# Altium schematic sheet GitKop.SchDoc
size A4; Author: Paweł Reich; SheetNumber: 1; SheetTotal: 1
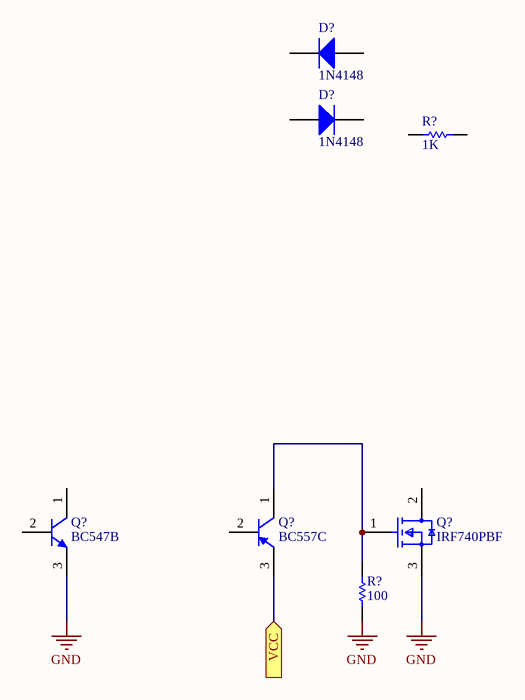
[diagram p0: GitKop.SchDoc]

## Parts
(Parts that share a designator on the sheet are numbered #1, #2 ... from top to bottom, then left to right.)
D?#1  1N4148  [NXP-SOD27-2_V]
D?#2  1N4148  [NXP-SOD27-2_V]
Q?#1  BC547B  [ONSC-TO-92-3-29-11]
Q?#2  BC557C  [ONSC-TO-92-3-29-11]
Q?#3  IRF740PBF  [FP-X15-0364-MFG]
R?#1  value 1K  (hidden comment: Resistor)
R?#2  value 100  (hidden comment: Resistor)

## Ports
VCC (in)

## Nets
GND: Q?#1.3(E) Q?#3.3(S) R?#2.2
VCC: Q?#2.3(E) ; port VCC
NetQ?#2_1: Q?#2.1(C) Q?#3.1(G) R?#2.1

Not connected (* = marked no-connect by the designer): D?#1 1(A) 2(K); D?#2 1(A) 2(K); Q?#1 1(C) 2(B); Q?#2 2(B); Q?#3 2(D); R?#1 1 2

## Notes on the sheet
- Title:
- Drawn By:
- Page Contents:
- Checked By:
- Size:
- Date:
- File:
- License:
- Email:
- A4
- Number:
- Time:
- Revision:
- Sheet
- Website:
- of

## Library data of the parts
D?#1 D?#2 = CMP-0648-00002-1: High-speed Diode, 100 V, 450 mA, 2-Pin SOD27, RoHS; Manufacturer: NXP Semiconductors; Configuration: Single; IR (VR: 20 V)=25 nA; IFRM: 450 mA; IFSM: 4 A Max.; Trr: 4 ns Max.; Cd: 4 pF Max.; VR: 100 V Max.; VF (IF: 10 mA)=1 V; IF: 200 mA Max.; ComponentLink1Description: Manufacturer URL; RoHS: TRUE; ComponentLink1URL: http://www.nxp.com/; ComponentLink3Description: Package Specification; DatasheetVersion: Aug-04; ComponentLink2Description: Datasheet; PackageVersion: Aug-04; PackageReference: SOD27; ComponentLink3URL: http://www.nxp.com/documents/data_sheet/1N4148_1N4448.pdf; Mounting Technology: Through Hole; ComponentLink2URL: http://www.nxp.com/documents/data_sheet/1N4148_1N4448.pdf; PartNumber: 1N4148; PackageDescription: 2-Pin Hermetically Sealed Glass Package, Axial Leaded, Dia 1.85 mm, Body Length 4.25 mm, Lead Spread 25.4 mm
Q?#1 = CMP-1048-01467-1: Amplifier Transistor, NPN Silicon, 3-Pin TO-92, Bulk Box; Manufacturer: On Semiconductor; IC Continuous (A): 0.1; fT Min (MHz): 150; DatasheetVersion: Rev. 7; ComponentLink1URL: http://www.onsemi.com/; Polarity: NPN; RoHS: FALSE; ComponentLink1Description: Manufacturer URL; Packing: Bulk Box; PackageDescription: 3-Pin Transistor Outline, Body 4.825 x 3.685 mm, Pitch 1.27 mm; ComponentLink3URL: http://www.onsemi.cn/pub_link/Collateral/2N6426-D.PDF; ComponentLink2Description: Datasheet; PackageVersion: Rev. AM; PackageReference: TO-92-3-29-11_AM_SL; ComponentLink3Description: Package Specification; Mounting Technology: Through Hole; PartNumber: BC547B; ComponentLink2URL: http://www.onsemi.com/pub_link/Collateral/BC546-D.PDF
Q?#2 = CMP-1048-01449-1: Amplifier Transistor, PNP Silicon, 3-Pin TO-92, Bulk Box; Manufacturer: On Semiconductor; IC Continuous (A): -0.1; Polarity: PNP; PartNumber: BC557C; PackageVersion: Rev. AM; RoHS: FALSE; PackageDescription: 3-Pin Transistor Outline, Body 4.825 x 3.685 mm, Pitch 1.27 mm; Packing: Bulk Box; ComponentLink2Description: Datasheet; DatasheetVersion: Rev. 3; ComponentLink3Description: Package Specification; Mounting Technology: Through Hole; ComponentLink2URL: http://www.onsemi.com/pub_link/Collateral/BC556B-D.PDF; ComponentLink1URL: http://www.onsemi.com/; ComponentLink1Description: Manufacturer URL; ComponentLink3URL: http://www.onsemi.cn/pub_link/Collateral/2N6426-D.PDF; PackageReference: TO-92-3-29-11_AM_SL
Q?#3 = CMP-02550-000088-1: MOSFET N-CH 400V 10A TO-220AB; Manufacturer: Vishay; Power Dissipation: 125W; Turn On Delay Time: 14ns; Standoff Height: 3.33mm; Max Junction Temp: +150°C; Number Of Channels: 1; Reverse Recovery Charge: 3800nC; Turn Off Delay Time: 50ns; Threshold Vgs Min: 2V; Input Capacitace At Vds: 1400pF @ 25V; Depletion Mode: False; Gate Charge At Vgs: 63nC @ 10V; Rthja Max: 62°C/W; Threshold Vgs Max: 4V; Gate To Source Voltage: 20V; Pulse Drain Current: 40A; Reverse Recovery Time: 370ns; Drain To Source Resistance: 0.55Ω; Temperature Range Low: -55°C; Mouser Description: MOSFET N-Chan 400V 10 Amp; Package: X15-0364; RoHS: TRUE; Manufacturer Part Number: IRF740PBF; Category: Trans; Drain To Source Voltage: 400V; Drain To Source Breakdown Voltage: 400V; Device Class L3: MOSFETs; Lead Free: Yes; Height: 19.89mm; Continuous Drain Current: 10A; Octopart: https://octopart.com/irf740pbf-vishay-46527100; Automotive: No; Max Forward Diode Voltage: 2V; Device Class L1: Discrete Semiconductors; ComponentLink2URL: http://www.vishay.com/docs/91054/91054.pdf; Temperature Range High: +150°C; Device Class L2: Transistors; ComponentLink2Description: Datasheet; Temperature: -55°C to +150°C; Number Of N Channels: 1; Digikey Description: MOSFET N-CH 400V 10A TO-220AB
R?#1 R?#2 = Resistor: TC1: 0; SimulationGenericComponent: True; TC2: 0